# Altium project AnchorBoard_SNS.PrjPcb
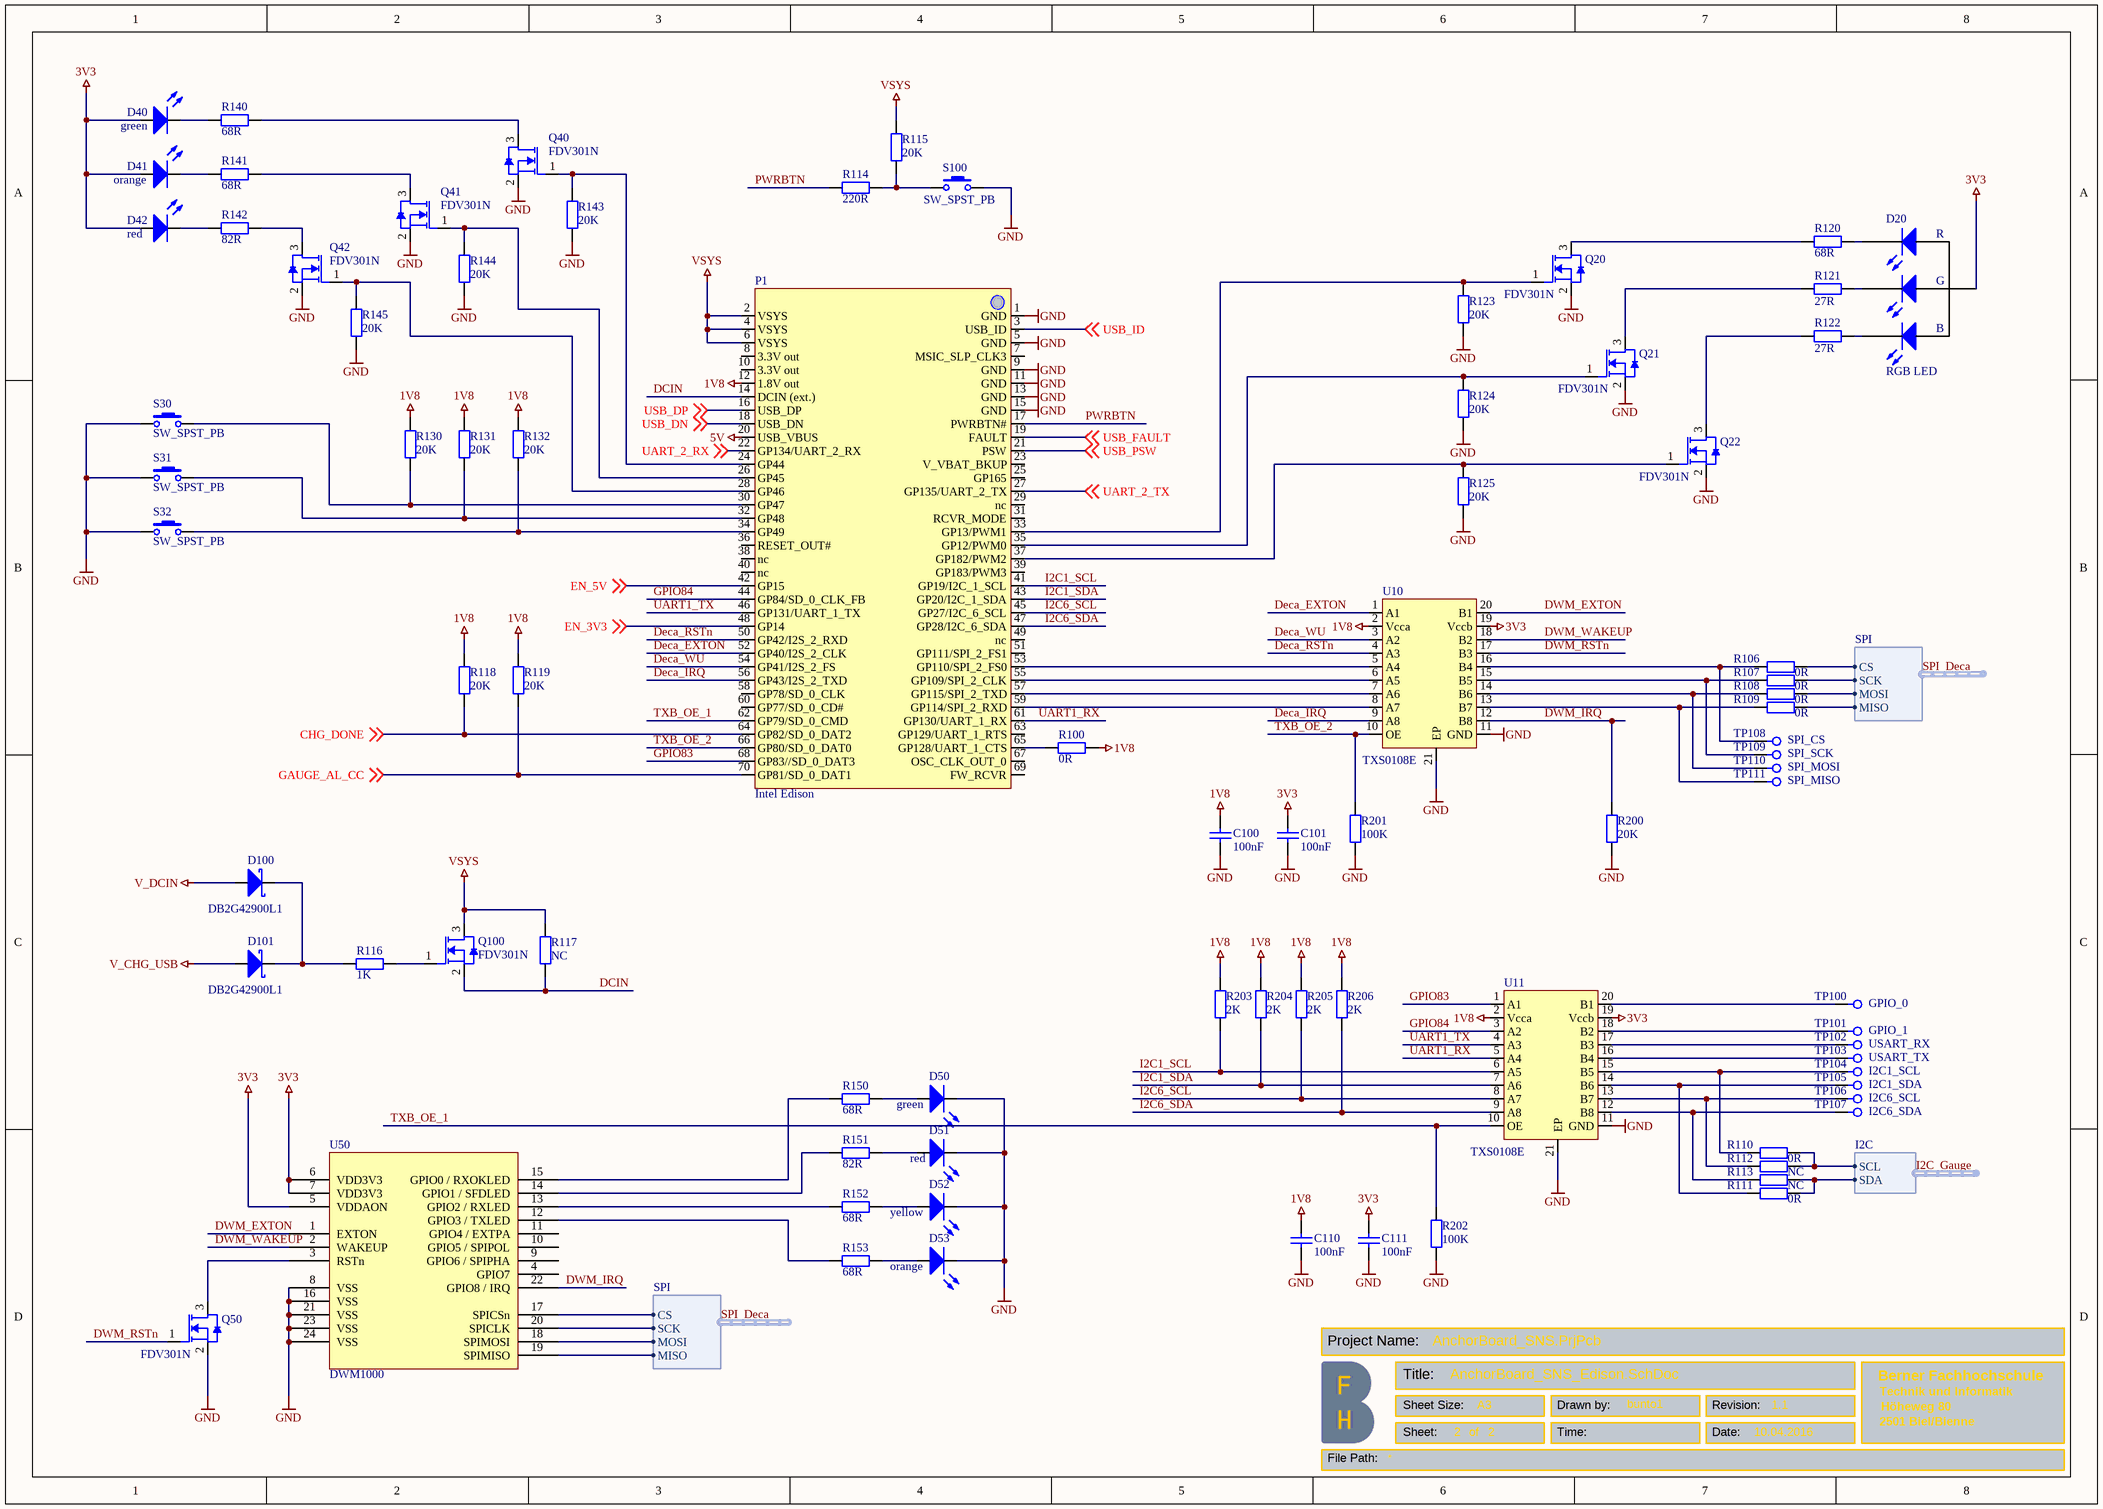
[diagram p0: AnchorBoard_SNS_Edison.SchDoc]
2 sheets, 153 parts. Net scope: global (net labels, ports and power ports of the same name join across sheets).
Board files: AnchorBoardSmall_SNS.PcbDoc, EdisonDecaAnchor_Redesign.PcbDoc
Sheets:
  AnchorBoard_SNS_Edison.SchDoc
  AnchorBoard_SNS_Power.SchDoc

## Sheet AnchorBoard_SNS_Edison.SchDoc
size A3; Date: 10.04.2016; Author: bunto1; DrawnBy: bunto1; Organization: BFH; Address1: Berner Fachhochschule; Address2: Technik und Informatik; Address3: Höheweg 80; Address4: 2501 Biel/Bienne; DocumentNumber: 1; Revision: 1.1; SheetNumber: 2; SheetTotal: 2; CurrentDate: 10.04.2016

### Parts
C100  100nF  [CAPC1005X50]
C101  100nF  [CAPC1005X50]
C110  100nF  [CAPC1005X50]
C111  100nF  [CAPC1005X50]
D20  RGB LED  [PLCC160P350X280X190-4]
D40  green  [LEDM1608X80]
D41  orange  [LEDM1608X80]
D42  red  [LEDM1608X80]
D50  green  [LEDM1608X80]
D51  red  [LEDM1608X80]
D52  yellow  [LEDM1608X80]
D53  orange  [LEDM1608X80]
D100  DB2G42900L1  [DIOC1006X10]
D101  DB2G42900L1  [DIOC1006X10]
P1  Intel Edison  [HDRV70W12P40_2X35_Edison]
Q20  FDV301N  [SOT190P360X120-3]
Q21  FDV301N  [SOT190P360X120-3]
Q22  FDV301N  [SOT190P360X120-3]
Q40  FDV301N  [SOT190P360X120-3]
Q41  FDV301N  [SOT190P360X120-3]
Q42  FDV301N  [SOT190P360X120-3]
Q50  FDV301N  [SOT190P360X120-3]
Q100  FDV301N  [SOT190P360X120-3]
R100  0R  [RESC1005X35]
R106  0R  [RESC1005X35]
R107  0R  [RESC1005X35]
R108  0R  [RESC1005X35]
R109  0R  [RESC1005X35]
R110  0R  [RESC1005X35]
R111  0R  [RESC1005X35]
R112  NC  [RESC1005X35]
R113  NC  [RESC1005X35]
R114  220R  [RESC1005X35]
R115  20K  [RESC1005X35]
R116  1K  [RESC1005X35]
R117  NC  [RESC1005X35]
R118  20K  [RESC1005X35]
R119  20K  [RESC1005X35]
R120  68R  [RESC1005X35]
R121  27R  [RESC1005X35]
R122  27R  [RESC1005X35]
R123  20K  [RESC1005X35]
R124  20K  [RESC1005X35]
R125  20K  [RESC1005X35]
R130  20K  [RESC1005X35]
R131  20K  [RESC1005X35]
R132  20K  [RESC1005X35]
R140  68R  [RESC1005X35]
R141  68R  [RESC1005X35]
R142  82R  [RESC1005X35]
R143  20K  [RESC1005X35]
R144  20K  [RESC1005X35]
R145  20K  [RESC1005X35]
R150  68R  [RESC1005X35]
R151  82R  [RESC1005X35]
R152  68R  [RESC1005X35]
R153  68R  [RESC1005X35]
R200  20K  [RESC1005X35]
R201  100K  [RESC1005X35]
R202  100K  [RESC1005X35]
R203  2K  [RESC1005X35]
R204  2K  [RESC1005X35]
R205  2K  [RESC1005X35]
R206  2K  [RESC1005X35]
S30  SW_SPST_PB  [SW_7914J-1-000E]
S31  SW_SPST_PB  [SW_7914J-1-000E]
S32  SW_SPST_PB  [SW_7914J-1-000E]
S100  SW_SPST_PB  [SW_7914J-1-000E]
TP100  GPIO_0  [TP_THT]
TP101  GPIO_1  [TP_THT]
TP102  USART_RX  [TP_THT]
TP103  USART_TX  [TP_THT]
TP104  I2C1_SCL  [TP_THT]
TP105  I2C1_SDA  [TP_THT]
TP106  I2C6_SCL  [TP_THT]
TP107  I2C6_SDA  [TP_THT]
TP108  SPI_CS  [TP_THT]
TP109  SPI_SCK  [TP_THT]
TP110  SPI_MOSI  [TP_THT]
TP111  SPI_MISO  [TP_THT]
U10  TXS0108E  [QFN50P47X37X100-21]
U11  TXS0108E  [QFN50P47X37X100-21]
U50  DWM1000  [DECAWAVE_DWM1000]

### Harnesses
SPI: SCK, MOSI, MISO, CS
I2C: SCL, SDA

### Nets
1V8: C100.2 C110.2 P1.12(1.8V_out) R100.2 R118.1 R119.1 R130.1 R131.1 R132.1 R203.1 R204.1 R205.1 R206.1 U10.2(Vcca) U11.2(Vcca)
3V3: C101.2 C111.2 D20.2(A) D40.1(A) D41.1(A) D42.1(A) U10.19(Vccb) U11.19(Vccb) U50.5(VDDAON) U50.6(VDD3V3) U50.7(VDD3V3)
5V: P1.20(USB_VBUS)
GND: C100.1 C101.1 C110.1 C111.1 D50.2(K) D51.2(K) D52.2(K) D53.2(K) P1.1(GND) P1.5(GND) P1.9(GND) P1.11(GND) P1.13(GND) P1.15(GND) Q20.2(S) Q21.2(S) Q22.2(S) Q40.2(S) Q41.2(S) Q42.2(S) Q50.2(S) R123.2 R124.2 R125.2 R143.2 R144.2 R145.2 R200.2 R201.2 R202.2 S30.1 S31.1 S32.1 S100.2 U10.11(GND) U10.21(EP) U11.11(GND) U11.21(EP) U50.8(VSS) U50.16(VSS) U50.21(VSS) U50.23(VSS) U50.24(VSS)
V_CHG_USB: D101.2(A)
V_DCIN: D100.2(A)
VSYS: P1.2(VSYS) P1.4(VSYS) P1.6(VSYS) Q100.3(D) R115.1 R117.2
CHG_DONE: P1.64(GP82/SD_0_DAT2) R118.2 ; off-sheet CHG_DONE
DCIN: P1.14(DCIN_(ext.)) Q100.2(S) R117.1
Deca_EXTON: P1.52(GP40/I2S_2_CLK) U10.1(A1)
Deca_IRQ: P1.56(GP43/I2S_2_TXD) U10.9(A8)
Deca_RSTn: P1.50(GP42/I2S_2_RXD) U10.4(A3)
Deca_WU: P1.54(GP41/I2S_2_FS) U10.3(A2)
DWM_EXTON: U10.20(B1) U50.1(EXTON)
DWM_IRQ: R200.1 U10.12(B8) U50.22(GPIO8_/_IRQ)
DWM_RSTn: Q50.1(G) U10.17(B3)
DWM_WAKEUP: U10.18(B2) U50.2(WAKEUP)
EN_3V3: P1.48(GP14) ; off-sheet EN_3V3  [project net Ena3V3]
EN_5V: P1.42(GP15) ; off-sheet EN_5V  [project net Ena5V]
GAUGE_AL_CC: P1.70(GP81/SD_0_DAT1) R119.2 ; off-sheet GAUGE_AL_CC
GPIO83: P1.68(GP83//SD_0_DAT3) U11.1(A1)
GPIO84: P1.44(GP84/SD_0_CLK_FB) U11.3(A2)
I2C1_SCL: P1.41(GP19/I2C_1_SCL) R203.2 U11.6(A5)
I2C1_SDA: P1.43(GP20/I2C_1_SDA) R204.2 U11.7(A6)
I2C6_SCL: P1.45(GP27/I2C_6_SCL) R205.2 U11.8(A7)
I2C6_SDA: P1.47(GP28/I2C_6_SDA) R206.2 U11.9(A8)
I2C_Gauge.SCL: R110.2 R112.2 ; harness I2C.SCL
I2C_Gauge.SDA: R111.2 R113.2 ; harness I2C.SDA
PWRBTN: P1.17(PWRBTN#) R114.1
SPI_Deca.CS: R106.2 U50.17(SPICSn) ; harness SPI.CS
SPI_Deca.MISO: R109.2 U50.19(SPIMISO) ; harness SPI.MISO
SPI_Deca.MOSI: R108.2 U50.18(SPIMOSI) ; harness SPI.MOSI
SPI_Deca.SCK: R107.2 U50.20(SPICLK) ; harness SPI.SCK
TXB_OE_1: P1.62(GP79/SD_0_CMD) R202.1 U11.10(OE)
TXB_OE_2: P1.66(GP80/SD_0_DAT0) R201.1 U10.10(OE)
UART1_RX: P1.61(GP130/UART_1_RX) U11.5(A4)
UART1_TX: P1.46(GP131/UART_1_TX) U11.4(A3)
UART_2_RX: P1.22(GP134/UART_2_RX) ; off-sheet UART_2_RX
UART_2_TX: P1.27(GP135/UART_2_TX) ; off-sheet UART_2_TX
USB_DN: P1.18(USB_DN) ; off-sheet USB_DN
USB_DP: P1.16(USB_DP) ; off-sheet USB_DP
USB_FAULT: P1.19(FAULT) ; off-sheet USB_FAULT
USB_ID: P1.3(USB_ID) ; off-sheet USB_ID
USB_PSW: P1.21(PSW) ; off-sheet USB_PSW
NetD20_1: D20.1(K1) R120.2
NetD20_3: D20.3(K3) R122.2
NetD20_4: D20.4(K2) R121.2
NetD40_2: D40.2(K) R140.1
NetD41_2: D41.2(K) R141.1
NetD42_2: D42.2(K) R142.1
NetD50_1: D50.1(A) R150.2
NetD51_1: D51.1(A) R151.2
NetD52_1: D52.1(A) R152.2
NetD53_1: D53.1(A) R153.2
NetD100_1: D100.1(K) D101.1(K) R116.1
NetP1_24: P1.24(GP44) Q40.1(G) R143.1
NetP1_26: P1.26(GP45) Q41.1(G) R144.1
NetP1_28: P1.28(GP46) Q42.1(G) R145.1
NetP1_30: P1.30(GP47) R130.2 S30.2
NetP1_32: P1.32(GP48) R131.2 S31.2
NetP1_33: P1.33(GP13/PWM1) Q20.1(G) R123.1
NetP1_34: P1.34(GP49) R132.2 S32.2
NetP1_35: P1.35(GP12/PWM0) Q21.1(G) R124.1
NetP1_37: P1.37(GP182/PWM2) Q22.1(G) R125.1
NetP1_53: P1.53(GP110/SPI_2_FS0) U10.5(A4)
NetP1_55: P1.55(GP109/SPI_2_CLK) U10.6(A5)
NetP1_57: P1.57(GP115/SPI_2_TXD) U10.7(A6)
NetP1_59: P1.59(GP114/SPI_2_RXD) U10.8(A7)
NetP1_65: P1.65(GP128/UART_1_CTS) R100.1
NetQ20_3: Q20.3(D) R120.1
NetQ21_3: Q21.3(D) R121.1
NetQ22_3: Q22.3(D) R122.1
NetQ40_3: Q40.3(D) R140.2
NetQ41_3: Q41.3(D) R141.2
NetQ42_3: Q42.3(D) R142.2
NetQ50_3: Q50.3(D) U50.3(RSTn)
NetQ100_1: Q100.1(G) R116.2
NetR106_1: R106.1 TP108.1(TP) U10.16(B4)
NetR107_1: R107.1 TP109.1(TP) U10.15(B5)
NetR108_1: R108.1 TP110.1(TP) U10.14(B6)
NetR109_1: R109.1 TP111.1(TP) U10.13(B7)
NetR110_1: R110.1 TP104.1(TP) U11.15(B5)
NetR111_1: R111.1 TP105.1(TP) U11.14(B6)
NetR112_1: R112.1 TP106.1(TP) U11.13(B7)
NetR113_1: R113.1 TP107.1(TP) U11.12(B8)
NetR114_2: R114.2 R115.2 S100.1
NetR150_1: R150.1 U50.15(GPIO0_/_RXOKLED)
NetR151_1: R151.1 U50.14(GPIO1_/_SFDLED)
NetR152_1: R152.1 U50.13(GPIO2_/_RXLED)
NetR153_1: R153.1 U50.12(GPIO3_/_TXLED)
NetTP100_1: TP100.1(TP) U11.20(B1)
NetTP101_1: TP101.1(TP) U11.18(B2)
NetTP102_1: TP102.1(TP) U11.17(B3)
NetTP103_1: TP103.1(TP) U11.16(B4)

Not connected (* = marked no-connect by the designer): P1 7(MSIC_SLP_CLK3) 8(3.3V_out) 10(3.3V_out) 23(V_VBAT_BKUP) 25(GP165) 29(nc) 31(RCVR_MODE) 36(RESET_OUT#) 38(nc) 39(GP183/PWM3) 40(nc) 49(nc) 51(GP111/SPI_2_FS1) 58(GP78/SD_0_CLK) 60(GP77/SD_0_CD#) 63(GP129/UART_1_RTS) 67(OSC_CLK_OUT_0) 69(FW_RCVR); U50 4(GPIO7) 9(GPIO6_/_SPIPHA) 10(GPIO5_/_SPIPOL) 11(GPIO4_/_EXTPA)

### Notes on the sheet
- Project Name:
- Title:
- File Path:
- Sheet Size:
- Sheet:
- of
- A3
- Drawn by:
- Time:
- Revision:
- Date:
- (in symbol LED_RGB_CA) R; G; B

### Library data of the parts
C100 C101 C110 C111 = Capacitor: Capacitor SMD; Manufacturer Number: GRM155R71A104KA01D; Value: 100nF; Supplier 1: Mouser; Supplier 2: Digi-Key; Supplier Part Number 1: 81-GRM155R71A104KA1D; Supplier Part Number 2: 490-6321-1-ND
D20 = LED_RGB_CA: RGB LED with common Anode; Manufacturer Number: CLVBA-FKA-CAEDH8BBB7A363; Supplier 1: Mouser; Supplier Part Number 1: 941-VBAFKACAEDH8B7A3; Supplier 2: Digi-Key; Supplier Part Number 2: CLVBA-FKA-CAEDH8BBB7A363CT-ND
D40 D50 = LED_green: Light Emitting Diode; Manufacturer Number: LTST-C190KGKT; Manufacturer: Lite-On; Forward_Current: 20mA; Modified_by: bunto1; Forward_Voltage: 2V; Modified: 15.04.2016; Color: green; Supplier 1: Mouser; Supplier Part Number 1: 859-LTST-C190KGKT; Supplier 2: Digi-Key; Supplier Part Number 2: 160-1435-1-ND
D41 D53 = LED_orange: Light Emitting Diode; Manufacturer Number: LTST-C190KFKT; Manufacturer: Lite-On; Forward_Current: 20mA; Modified_by: bunto1; Forward_Voltage: 2V; Modified: 15.04.2016; Color: orange; Supplier 1: Mouser; Supplier Part Number 1: 859-LTST-C190KFKT; Supplier 2: Digi-Key; Supplier Part Number 2: 160-1434-1-ND
D42 D51 = LED_red: Light Emitting Diode; Manufacturer Number: LTST-C190KRKT; Manufacturer: Lite-On; Forward_Current: 20mA; Modified_by: bunto1; Forward_Voltage: 2V; Modified: 15.04.2016; Color: red; Supplier 1: Mouser; Supplier Part Number 1: 859-LTST-C190KRKT; Supplier 2: Digi-Key; Supplier Part Number 2: 160-1436-1-ND
D52 = LED_yellow: Light Emitting Diode; Manufacturer Number: LTST-C190KSKT; Manufacturer: Lite-On; Forward_Current: 20mA; Modified_by: bunto1; Forward_Voltage: 2V; Modified: 15.04.2016; Color: yellow; Supplier 1: Mouser; Supplier Part Number 1: 859-LTST-C190KSKT; Supplier 2: Digi-Key; Supplier Part Number 2: 160-1437-1-ND
D100 D101 = D_SCHOTTKY: Schottky Diode; Reverse_Voltage: 40V; Manufacturer Number: DB2G42900L1; Supplier 1: Mouser; Supplier 2: Digi-Key; Supplier Part Number 1: 667-DB2G42900L1; Supplier Part Number 2: P18982CT-ND; Value: DB2G42900L1
P1 = Intel Edison Header: Intel Edison Header, 70-Pin Dual row; Manufacturer Number: DF40C-70DS-0.4V(51); Supplier 1: Mouser; Supplier Part Number 1: 798-DF40C70DS04V51; Supplier 2: Digi-Key; Supplier Part Number 2: H11631CT-ND
Q20-Q22 Q40-Q42 Q50 Q100 = FDV301N: N-Channel MOSFET; Supplier 1: Mouser; Supplier Part Number 1: 512-FDV301N; Manufacturer Number: FDV301N; Supplier 2: Digi-Key; Supplier Part Number 2: FDV301NCT-ND
R100 R106-R111 = Resistor: Manufacturer Number: ERJ-2GE0R00X; Value: 0R; Supplier 1: Mouser; Supplier 2: Digi-Key; Supplier Part Number 1: 667-ERJ-2GE0R00X; Supplier Part Number 2: P0.0JCT-ND
R112 R113 R117 = Resistor: Value: NC; Supplier 1: Mouser; Supplier 2: Digi-Key
R114 = Resistor: Manufacturer Number: ERJ-2RKF2200X; Value: 220R; Supplier 1: Mouser; Supplier 2: Digi-Key; Supplier Part Number 1: 667-ERJ-2RKF2200X; Supplier Part Number 2: P220LCT-ND
R115 R118 R119 R123-R125 R130-R132 R143-R145 R200 = Resistor: Manufacturer Number: ERJ-2RKF2002X; Value: 20K; Supplier Part Number 1: 667-ERJ-2RKF2002X; Supplier Part Number 2: P20.0KLCT-ND; Supplier 2: Digi-Key; Supplier 1: Mouser
R116 = Resistor: Manufacturer Number: ERJ-2RKF1001X; Value: 1K; Supplier 1: Mouser; Supplier 2: Digi-Key; Supplier Part Number 1: 667-ERJ-2RKF1001X; Supplier Part Number 2: P1.00KLCT-ND
R120 R140 R141 R150 R152 R153 = Resistor: Manufacturer Number: ERJ-2RKF68R0X; Value: 68R; Supplier 1: Mouser; Supplier 2: Digi-Key; Supplier Part Number 1: 667-ERJ-2RKF68R0X; Supplier Part Number 2: P68.0LCT-ND
R121 R122 = Resistor: Manufacturer Number: ERJ-2RKF27R0X; Value: 27R; Supplier 1: Mouser; Supplier 2: Digi-Key; Supplier Part Number 1: 667-ERJ-2RKF27R0X; Supplier Part Number 2: P27.0LCT-ND
R142 R151 = Resistor: Manufacturer Number: ERJ-2RKF82R0X; Value: 82R; Supplier 1: Mouser; Supplier 2: Digi-Key; Supplier Part Number 1: 667-ERJ-2RKF82R0X; Supplier Part Number 2: P82.0LCT-ND
R201 R202 = Resistor: Manufacturer Number: ERJ-2RKF1003X; Value: 100K; Supplier 2: Digi-Key; Supplier 1: Mouser; Supplier Part Number 1: 667-ERJ-2RKF1003X; Supplier Part Number 2: P100KLCT-ND
R203-R206 = Resistor: Manufacturer Number: ERJ-2RKF2001X; Value: 2K; Supplier 1: Mouser; Supplier 2: Digi-Key; Supplier Part Number 1: 667-ERJ-2RKF2001X; Supplier Part Number 2: P2.00KLCT-ND
S30-S32 S100 = SW_SPST_PB: Switch PB; Manufacturer Number: 7914J-1-000E; Supplier 1: Mouser; Supplier 2: Digi-Key; Supplier Part Number 1: 652-7914J-1-000E; Supplier Part Number 2: 7914J-000ECT-ND
TP100-TP111 = TP1: Test-Point; Values: *; Order Nbr: *; Distributor: *; Manufacturer: *; Divers: *; Price: *; Marking: *
U10 U11 = TXS0108ERGYR: 8-Bit Bidirectional Voltage-Level Translator; Supplier 2: Digi-Key; Supplier Part Number 2: 296-24806-1-ND; Supplier Part Number 1: 595-TXS0108ERGYR; Supplier 1: Mouser; Manufacturer Number: TXS0108ERGYR
U50 = DWM1000: MOD IEEE802.15.4-2011 UWB TXRX; Supplier Part Number 2: 1479-1002-1-ND; Supplier 2: Digi-Key; Manufacturer Number: DWM1000; Value: DWM1000; Supplier 1: Mouser

## Sheet AnchorBoard_SNS_Power.SchDoc
size A3; Date: 25.03.2015; Author: bunto1; DrawnBy: bunto1; Organization: BFH; Address1: Berner Fachhochschule; Address2: Technik und Informatik; Address3: Höheweg 80; Address4: 2501 Biel/Bienne; DocumentNumber: 1; Revision: 1.1; SheetNumber: 1; SheetTotal: 2; CurrentDate: 25.03.2016
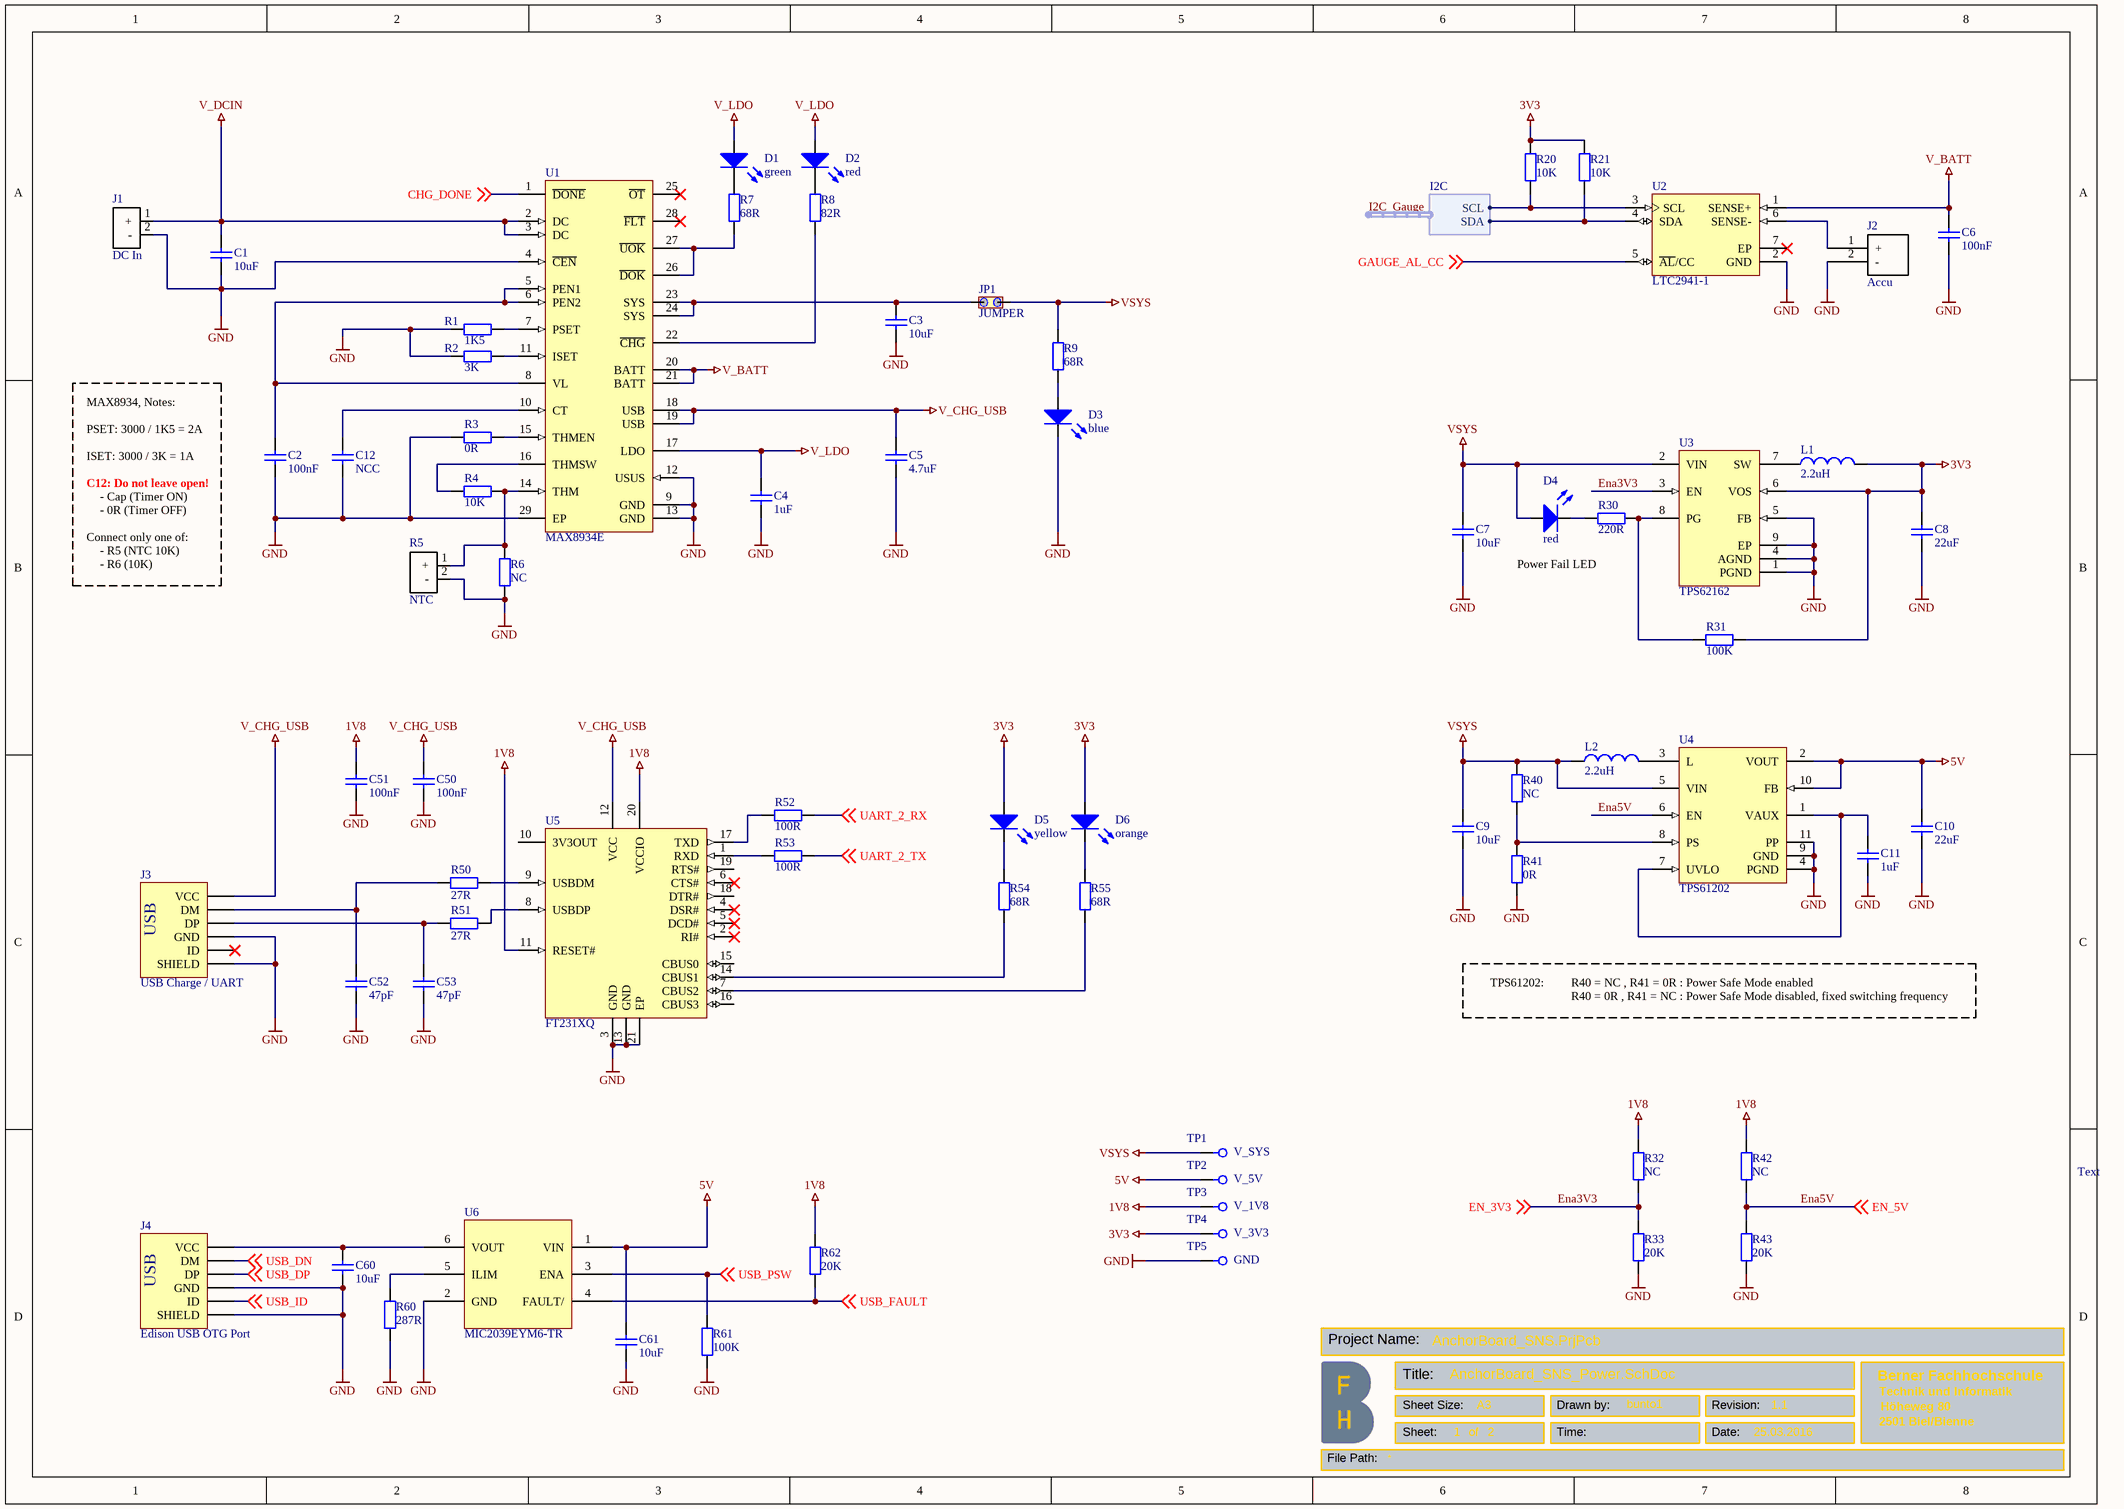
[diagram p1: AnchorBoard_SNS_Power.SchDoc]

### Parts
C1  10uF  [CAPC1608X80]
C2  100nF  [CAPC1005X50]
C3  10uF  [CAPC1608X80]
C4  1uF  [CAPC1005X50]
C5  4.7uF  [CAPC1608X80]
C6  100nF  [CAPC1005X50]
C7  10uF  [CAPC1608X80]
C8  22uF  [CAPC1608X80]
C9  10uF  [CAPC1608X80]
C10  22uF  [CAPC1608X80]
C11  1uF  [CAPC1005X50]
C12  NCC  [RESC1005X35]
C50  100nF  [CAPC1005X50]
C51  100nF  [CAPC1005X50]
C52  47pF  [CAPC1005X50]
C53  47pF  [CAPC1005X50]
C60  10uF  [CAPC1608X80]
C61  10uF  [CAPC1608X80]
D1  green  [LEDM1608X80]
D2  red  [LEDM1608X80]
D3  blue  [LEDM1608X80]
D4  red  [LEDM1608X80]
D5  yellow  [LEDM1608X80]
D6  orange  [LEDM1608X80]
J1  DC In  [ACCU_PORT]
J2  Accu  [ACCU_PORT]
J3  USB Charge / UART  [MOLEX_0473460001]
J4  Edison USB OTG Port  [MOLEX_0473460001]
JP1  JUMPER  [HDR1X2_V_M]
L1  2.2uH  [INDM2929X140]
L2  2.2uH  [INDM2929X140]
R1  1K5  [RESC1005X35]
R2  3K  [RESC1005X35]
R3  0R  [RESC1005X35]
R4  10K  [RESC1005X35]
R5  NTC  [ACCU_PORT]
R6  NC  [RESC1005X35]
R7  68R  [RESC1005X35]
R8  82R  [RESC1005X35]
R9  68R  [RESC1005X35]
R20  10K  [RESC1005X35]
R21  10K  [RESC1005X35]
R30  220R  [RESC1005X35]
R31  100K  [RESC1005X35]
R32  NC  [RESC1005X35]
R33  20K  [RESC1005X35]
R40  NC  [RESC1005X35]
R41  0R  [RESC1005X35]
R42  NC  [RESC1005X35]
R43  20K  [RESC1005X35]
R50  27R  [RESC1005X35]
R51  27R  [RESC1005X35]
R52  100R  [RESC1005X35]
R53  100R  [RESC1005X35]
R54  68R  [RESC1005X35]
R55  68R  [RESC1005X35]
R60  287R  [RESC1005X35]
R61  100K  [RESC1005X35]
R62  20K  [RESC1005X35]
TP1  V_SYS  [TP_THT]
TP2  V_5V  [TP_THT]
TP3  V_1V8  [TP_THT]
TP4  V_3V3  [TP_THT]
TP5  GND  [TP_THT]
U1  MAX8934E  [QFN40P40X40X80-29]
U2  LTC2941-1  [DFN30X20X80-6]
U3  TPS62162  [SON50P210X210X80-9]
U4  TPS61202  [SON50P310X310X100-11]
U5  FT231XQ  [QFN50P40X40X80-21]
U6  MIC2039EYM6-TR  [SOT95P360X130-6]

### Harnesses
I2C: SCL, SDA

### Nets
1V8: C51.2 R32.2 R42.2 R62.1 TP3.1(TP) U5.11(RESET#) U5.20(VCCIO)
3V3: C8.2 D5.1(A) D6.1(A) L1.2 R20.1 R21.1 R31.2 TP4.1(TP) U3.6(VOS)
5V: C10.2 C61.2 TP2.1(TP) U4.2(VOUT) U4.10(FB) U6.1(VIN)
GND: C1.1 C2.1 C3.1 C4.1 C5.1 C6.1 C7.1 C8.1 C9.1 C10.1 C11.1 C12.1 C50.1 C51.1 C52.1 C53.1 C60.1 C61.1 D3.2(K) J1.2(-) J2.2(-) J3.5(GND) J3.6(SHIELD) J4.5(GND) J4.6(SHIELD) R1.2 R2.2 R3.1 R5.2(-) R6.2 R33.2 R41.1 R43.2 R60.2 R61.2 TP5.1(TP) U1.4(~{CEN}) U1.9(GND) U1.12(USUS) U1.13(GND) U1.29(EP) U2.2(GND) U3.1(PGND) U3.4(AGND) U3.5(FB) U3.9(EP) U4.4(PGND) U4.9(GND) U4.11(PP) U5.3(GND) U5.13(GND) U5.21(EP) U6.2(GND)
V_BATT: C6.2 U1.20(BATT) U1.21(BATT) U2.1(SENSE+)
V_CHG_USB: C5.2 C50.2 J3.1(VCC) U1.18(USB) U1.19(USB) U5.12(VCC)
V_DCIN: C1.2 J1.1(+) U1.2(DC) U1.3(DC)
V_LDO: C4.2 D1.1(A) D2.1(A) U1.17(LDO)
VSYS: C7.2 C9.2 D4.1(A) JP1.2 L2.1 R9.1 R40.2 TP1.1(TP) U3.2(VIN) U4.5(VIN)
CHG_DONE: U1.1(~{DONE}) ; off-sheet CHG_DONE
Ena3V3: R32.1 R33.1 U3.3(EN) ; off-sheet EN_3V3  [also labelled EN_3V3]
Ena5V: R42.1 R43.1 U4.6(EN) ; off-sheet EN_5V  [also labelled EN_5V]
GAUGE_AL_CC: U2.5(~{AL}/CC) ; off-sheet GAUGE_AL_CC
I2C_Gauge.SCL: R20.2 U2.3(SCL) ; harness I2C.SCL
I2C_Gauge.SDA: R21.2 U2.4(SDA) ; harness I2C.SDA
UART_2_RX: R52.1 ; off-sheet UART_2_RX
UART_2_TX: R53.1 ; off-sheet UART_2_TX
USB_DN: J4.2(DM) ; off-sheet USB_DN
USB_DP: J4.3(DP) ; off-sheet USB_DP
USB_FAULT: R62.2 U6.4(FAULT/) ; off-sheet USB_FAULT
USB_ID: J4.4(ID) ; off-sheet USB_ID
USB_PSW: R61.1 U6.3(ENA) ; off-sheet USB_PSW
NetC2_2: C2.2 U1.5(PEN1) U1.6(PEN2) U1.8(VL)
NetC3_2: C3.2 JP1.1 U1.23(SYS) U1.24(SYS)
NetC11_2: C11.2 U4.1(VAUX) U4.7(UVLO)
NetC12_2: C12.2 U1.10(CT)
NetC52_2: C52.2 J3.2(DM) R50.1
NetC53_2: C53.2 J3.3(DP) R51.1
NetC60_2: C60.2 J4.1(VCC) U6.6(VOUT)
NetD1_2: D1.2(K) R7.1
NetD2_2: D2.2(K) R8.2
NetD3_1: D3.1(A) R9.2
NetD4_2: D4.2(K) R30.1
NetD5_2: D5.2(K) R54.1
NetD6_2: D6.2(K) R55.2
NetJ2_1: J2.1(+) U2.6(SENSE-)
NetL1_1: L1.1 U3.7(SW)
NetL2_2: L2.2 U4.3(L)
NetR1_1: R1.1 U1.7(PSET)
NetR2_1: R2.1 U1.11(ISET)
NetR3_2: R3.2 U1.15(THMEN)
NetR4_1: R4.1 R5.1(+) R6.1 U1.14(THM)
NetR4_2: R4.2 U1.16(THMSW)
NetR7_2: R7.2 U1.26(~{DOK}) U1.27(~{UOK})
NetR8_1: R8.1 U1.22(~{CHG})
NetR30_2: R30.2 R31.1 U3.8(PG)
NetR40_1: R40.1 R41.2 U4.8(PS)
NetR50_2: R50.2 U5.9(USBDM)
NetR51_2: R51.2 U5.8(USBDP)
NetR52_2: R52.2 U5.17(TXD)
NetR53_2: R53.2 U5.1(RXD)
NetR54_2: R54.2 U5.14(CBUS1)
NetR55_1: R55.1 U5.7(CBUS2)
NetR60_1: R60.1 U6.5(ILIM)

Not connected (* = marked no-connect by the designer): J3 4(ID)*; U1 25(~{OT})* 28(~{FLT})*; U2 7(EP)*; U5 2(RI#)* 4(DSR#)* 5(DCD#)* 6(CTS#)* 10(3V3OUT) 15(CBUS0) 16(CBUS3) 18(DTR#) 19(RTS#)

### Notes on the sheet
- PSET: 3000 / 1K5 = 2A
- MAX8934, Notes:
- ISET: 3000 / 3K = 1A
- (near C2) C12: Do not leave open!
- - Cap (Timer ON)
- - 0R (Timer OFF)
- Connect only one of:
- - R5 (NTC 10K)
- - R6 (10K)
- Power Fail LED
- TPS61202:
- R40 = NC , R41 = 0R : Power Safe Mode enabled
- R40 = 0R , R41 = NC : Power Safe Mode disabled, fixed switching frequency
- Text
- Project Name:
- Title:
- File Path:
- Sheet Size:
- Sheet:
- of
- A3
- Drawn by:
- Time:
- Revision:
- Date:
- (in symbol USB_micro_B) USB

### Library data of the parts
C1 C3 C7 C9 C60 C61 = Capacitor: Capacitor SMD Ceramic X7R; Manufacturer Number: GRM188R61A106KE69D; Value: 10uF; Supplier 1: Mouser; Supplier 2: Digi-Key; Supplier Part Number 1: 81-GRM188R61A106KE9D; Supplier Part Number 2: 490-10474-1-ND
C2 C6 C50 C51 = Capacitor: as C100 on sheet AnchorBoard_SNS_Edison; Value: 100nF; Supplier 1: Mouser; Supplier 2: Digi-Key; Supplier Part Number 1: 81-GRM155R71A104KA1D; Supplier Part Number 2: 490-6321-1-ND
C4 C11 = Capacitor: Capacitor SMD Ceramic X7R Low ESR; Manufacturer Number: GRM155R61A105ME15D; Value: 1uF; Supplier 1: Mouser; Supplier 2: Digi-Key; Supplier Part Number 1: 81-GRM155R61A105ME5D; Supplier Part Number 2: 490-5409-1-ND
C5 = Capacitor: Capacitor SMD Ceramic X7R; Manufacturer Number: GRM188R61A475KE15D; Value: 4.7uF; Supplier 1: Mouser; Supplier 2: Digi-Key; Supplier Part Number 1: 81-GRM188R61A475KE5D; Supplier Part Number 2: 490-10477-1-ND
C8 C10 = Capacitor: Capacitor SMD Ceramic X7R Low ESR; Manufacturer Number: GRM188R61A226ME15D; Value: 22uF; Supplier 1: Mouser; Supplier 2: Digi-Key; Supplier Part Number 1: 81-GRM188R61A226ME5D; Supplier Part Number 2: 490-10476-1-ND
C12 = Capacitor: Capacitor SMD Ceramic X7R; Value: NCC; Supplier 1: Mouser; Supplier 2: Digi-Key
C52 C53 = Capacitor: Capacitor SMD; Manufacturer Number: GRM1555C1H470FA01D; Value: 47pF; Supplier 1: Mouser; Supplier 2: Digi-Key; Supplier Part Number 1: 81-GRM1555C1H470FA1D; Supplier Part Number 2: 490-6241-1-ND
D1 = LED_green: as D40 on sheet AnchorBoard_SNS_Edison; Modified: 15.04.2016; Color: green; Supplier 1: Mouser; Supplier Part Number 1: 859-LTST-C190KGKT; Supplier 2: Digi-Key; Supplier Part Number 2: 160-1435-1-ND
D2 D4 = LED_red: as D42 on sheet AnchorBoard_SNS_Edison; Modified: 15.04.2016; Color: red; Supplier 1: Mouser; Supplier Part Number 1: 859-LTST-C190KRKT; Supplier 2: Digi-Key; Supplier Part Number 2: 160-1436-1-ND
D3 = LED_blue: Light Emitting Diode; Manufacturer Number: LTST-C190TBKT; Manufacturer: Lite-On; Forward_Current: 20mA; Modified_by: bunto1; Forward_Voltage: 3V; Modified: 15.04.2016; Color: blue; Supplier 1: Mouser; Supplier Part Number 1: 859-LTST-C190TBKT; Supplier 2: Digi-Key; Supplier Part Number 2: 160-1646-1-ND
D5 = LED_yellow: as D52 on sheet AnchorBoard_SNS_Edison; Modified: 15.04.2016; Color: yellow; Supplier 1: Mouser; Supplier Part Number 1: 859-LTST-C190KSKT; Supplier 2: Digi-Key; Supplier Part Number 2: 160-1437-1-ND
D6 = LED_orange: as D41 on sheet AnchorBoard_SNS_Edison; Modified: 15.04.2016; Color: orange; Supplier 1: Mouser; Supplier Part Number 1: 859-LTST-C190KFKT; Supplier 2: Digi-Key; Supplier Part Number 2: 160-1434-1-ND
J1 R5 = PORT_THT: 2-Pin THT Port
  J1: Value: DC In
  R5: Value: NTC
J2 = ACCU_PORT: Accu Port
J3 J4 = USB_micro_B: USB Connectors MICRO USB B RECPT; Manufacturer Number: 47346-0001; Supplier 1: Mouser; Supplier Part Number 1: 538-47346-0001; Supplier 2: Digi-Key; Supplier Part Number 2: WM17141CT-ND
L1 L2 = L: Inductor; Manufacturer Number: LPS3015-222MRC; Modified_by: BEP; Modified: 10.2008; Value: 2.2uH; Supplier 2: Digi-Key; Supplier 1: Mouser; Supplier Part Number 1: 994-LPS3015-222MRC
R1 = Resistor: Manufacturer Number: ERJ-2RKF1501X; Value: 1K5; Supplier 2: Digi-Key; Supplier 1: Mouser; Supplier Part Number 1: 667-ERJ-2RKF1501X; Supplier Part Number 2: P1.50KLCT-ND
R2 = Resistor: Manufacturer Number: ERJ-2RKF3001X; Value: 3K; Supplier 2: Digi-Key; Supplier 1: Mouser; Supplier Part Number 1: 667-ERJ-2RKF3001X; Supplier Part Number 2: P3.00KLCT-ND
R3 R41 = Resistor: Manufacturer Number: ERJ-2GE0R00X; Value: 0R; Supplier 1: Mouser; Supplier 2: Digi-Key; Supplier Part Number 1: 667-ERJ-2GE0R00X; Supplier Part Number 2: P0.0JCT-ND
R4 R20 R21 = Resistor: Manufacturer Number: ERJ-2RKF1002X; Value: 10K; Supplier 2: Digi-Key; Supplier 1: Mouser; Supplier Part Number 1: 667-ERJ-2RKF1002X; Supplier Part Number 2: P10.0KLCT-ND
R6 R32 R40 R42 = Resistor: Value: NC; Supplier 2: Digi-Key; Supplier 1: Mouser
R7 R9 R54 R55 = Resistor: Manufacturer Number: ERJ-2RKF68R0X; Value: 68R; Supplier 1: Mouser; Supplier 2: Digi-Key; Supplier Part Number 1: 667-ERJ-2RKF68R0X; Supplier Part Number 2: P68.0LCT-ND
R8 = Resistor: Manufacturer Number: ERJ-2RKF82R0X; Value: 82R; Supplier 1: Mouser; Supplier 2: Digi-Key; Supplier Part Number 1: 667-ERJ-2RKF82R0X; Supplier Part Number 2: P82.0LCT-ND
R30 = Resistor: Manufacturer Number: ERJ-2RKF2200X; Value: 220R; Supplier 1: Mouser; Supplier 2: Digi-Key; Supplier Part Number 1: 667-ERJ-2RKF2200X; Supplier Part Number 2: P220LCT-ND
R31 R61 = Resistor: Manufacturer Number: ERJ-2RKF1003X; Value: 100K; Supplier 2: Digi-Key; Supplier 1: Mouser; Supplier Part Number 1: 667-ERJ-2RKF1003X; Supplier Part Number 2: P100KLCT-ND
R33 R43 R62 = Resistor: Manufacturer Number: ERJ-2RKF2002X; Value: 20K; Supplier Part Number 1: 667-ERJ-2RKF2002X; Supplier Part Number 2: P20.0KLCT-ND; Supplier 2: Digi-Key; Supplier 1: Mouser
R50 R51 = Resistor: Manufacturer Number: ERJ-2RKF27R0X; Value: 27R; Supplier 1: Mouser; Supplier 2: Digi-Key; Supplier Part Number 1: 667-ERJ-2RKF27R0X; Supplier Part Number 2: P27.0LCT-ND
R52 R53 = Resistor: Manufacturer Number: ERJ-2RKF1000X; Value: 100R; Supplier 1: Mouser; Supplier 2: Digi-Key; Supplier Part Number 1: 667-ERJ-2RKF1000X; Supplier Part Number 2: P100LCT-ND
R60 = Resistor: Manufacturer Number: ERJ-2RKF2870X; Value: 287R; Supplier 2: Digi-Key; Supplier 1: Mouser; Supplier Part Number 1: 667-ERJ-2RKF2870X; Supplier Part Number 2: P287LCT-ND
TP1-TP5 = TP1: Test-Point; Values: *; Order Nbr: *; Distributor: *; Manufacturer: *; Divers: *; Price: *; Marking: *
U1 = MAX8934E: IC BATTERY CHARGER DUAL 28TQFN; Manufacturer Number: MAX8934EETI+; Supplier 2: Digi-Key; Supplier 1: Mouser; Supplier Part Number 1: 700-MAX8934EETI+; Supplier Part Number 2: MAX8934EETI+-ND
U2 = LTC2941-1: IC FUEL/GAS GAUGE LI-ION 1A 6DFN; Manufacturer Number: LTC2941IDCB-1#TRMPBF; Value: LTC2941-1; Supplier 2: Digi-Key; Supplier Part Number 2: LTC2941IDCB-1#TRMPBFCT-ND; Supplier 1: Mouser
U3 = TPS62162: IC REG BUCK 3.3V 1A SYNC 8WSON; Manufacturer Number: TPS62162DSGR; Supplier 1: Mouser; Supplier 2: Digi-Key; Value: TPS62162; Supplier Part Number 2: 296-43671-1-ND; Supplier Part Number 1: 595-TPS62162DSGR
U4 = TPS61202: IC REG BOOST 5V 1.2A SYNC 10SON; Manufacturer Number: TPS61202DRCR; Supplier 1: Mouser; Supplier 2: Digi-Key; Value: TPS61202; Supplier Part Number 1: 595-TPS61202DRCR; Supplier Part Number 2: 296-27462-1-ND
U5 = FT231XQ: IC USB SERIAL FULL UART 20QFN; Manufacturer Number: FT231XQ-R; Supplier 2: Digi-Key; Supplier 1: Mouser; Supplier Part Number 1: 895-FT231XQ-R; Supplier Part Number 2: 768-1128-1-ND
U6 = MIC2039: Adjustable Current Limit Power Switch; Supplier Part Number 1: 998-MIC2039EYM6TR; Supplier 1: Mouser; Manufacturer Number: MIC2039EYM6; Supplier 2: Digi-Key; Supplier Part Number 2: 576-4192-1-ND
JP1 = JUMPER: Values: *; Order Nbr: *; Distributor: *; Manufacturer: *; Divers: *; Price: *; Marking: *

## Nets that join several sheets
1V8: AnchorBoard_SNS_Edison (15 pins), AnchorBoard_SNS_Power (7 pins)
3V3: AnchorBoard_SNS_Edison (11 pins), AnchorBoard_SNS_Power (9 pins)
5V: AnchorBoard_SNS_Edison (P1.20), AnchorBoard_SNS_Power (6 pins)
GND: AnchorBoard_SNS_Edison (43 pins), AnchorBoard_SNS_Power (53 pins)
V_CHG_USB: AnchorBoard_SNS_Edison (D101.2), AnchorBoard_SNS_Power (6 pins)
V_DCIN: AnchorBoard_SNS_Edison (D100.2), AnchorBoard_SNS_Power (C1.2 J1.1 U1.2 U1.3)
VSYS: AnchorBoard_SNS_Edison (6 pins), AnchorBoard_SNS_Power (10 pins)
CHG_DONE: AnchorBoard_SNS_Edison (P1.64 R118.2), AnchorBoard_SNS_Power (U1.1)
Ena3V3: AnchorBoard_SNS_Edison (P1.48), AnchorBoard_SNS_Power (R32.1 R33.1 U3.3)
Ena5V: AnchorBoard_SNS_Edison (P1.42), AnchorBoard_SNS_Power (R42.1 R43.1 U4.6)
GAUGE_AL_CC: AnchorBoard_SNS_Edison (P1.70 R119.2), AnchorBoard_SNS_Power (U2.5)
I2C_Gauge.SCL: AnchorBoard_SNS_Edison (R110.2 R112.2), AnchorBoard_SNS_Power (R20.2 U2.3)
I2C_Gauge.SDA: AnchorBoard_SNS_Edison (R111.2 R113.2), AnchorBoard_SNS_Power (R21.2 U2.4)
UART_2_RX: AnchorBoard_SNS_Edison (P1.22), AnchorBoard_SNS_Power (R52.1)
UART_2_TX: AnchorBoard_SNS_Edison (P1.27), AnchorBoard_SNS_Power (R53.1)
USB_DN: AnchorBoard_SNS_Edison (P1.18), AnchorBoard_SNS_Power (J4.2)
USB_DP: AnchorBoard_SNS_Edison (P1.16), AnchorBoard_SNS_Power (J4.3)
USB_FAULT: AnchorBoard_SNS_Edison (P1.19), AnchorBoard_SNS_Power (R62.2 U6.4)
USB_ID: AnchorBoard_SNS_Edison (P1.3), AnchorBoard_SNS_Power (J4.4)
USB_PSW: AnchorBoard_SNS_Edison (P1.21), AnchorBoard_SNS_Power (R61.1 U6.3)